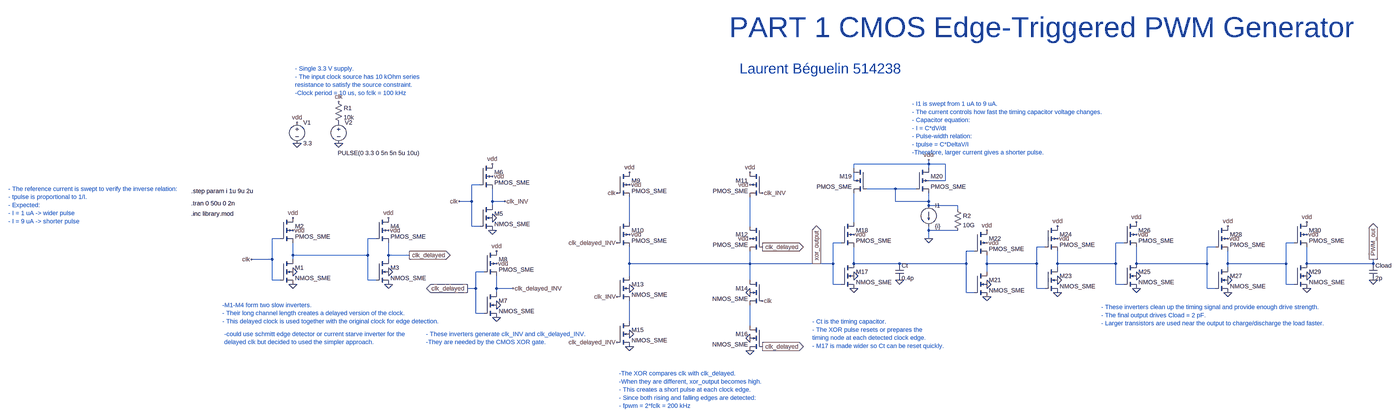
[diagram p0: schematic CMOS_Project_part1.asc, whole sheet]
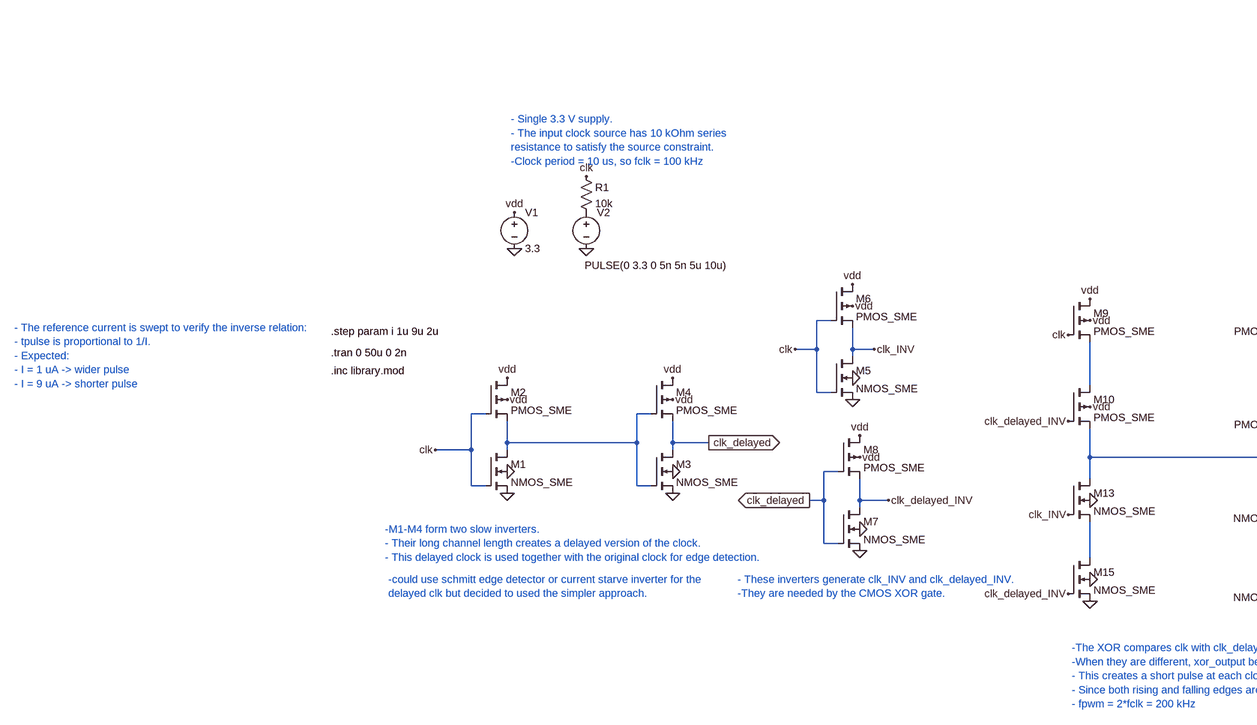
[diagram p1: schematic CMOS_Project_part1.asc, part, row 1 of 1, column 1 of 2]
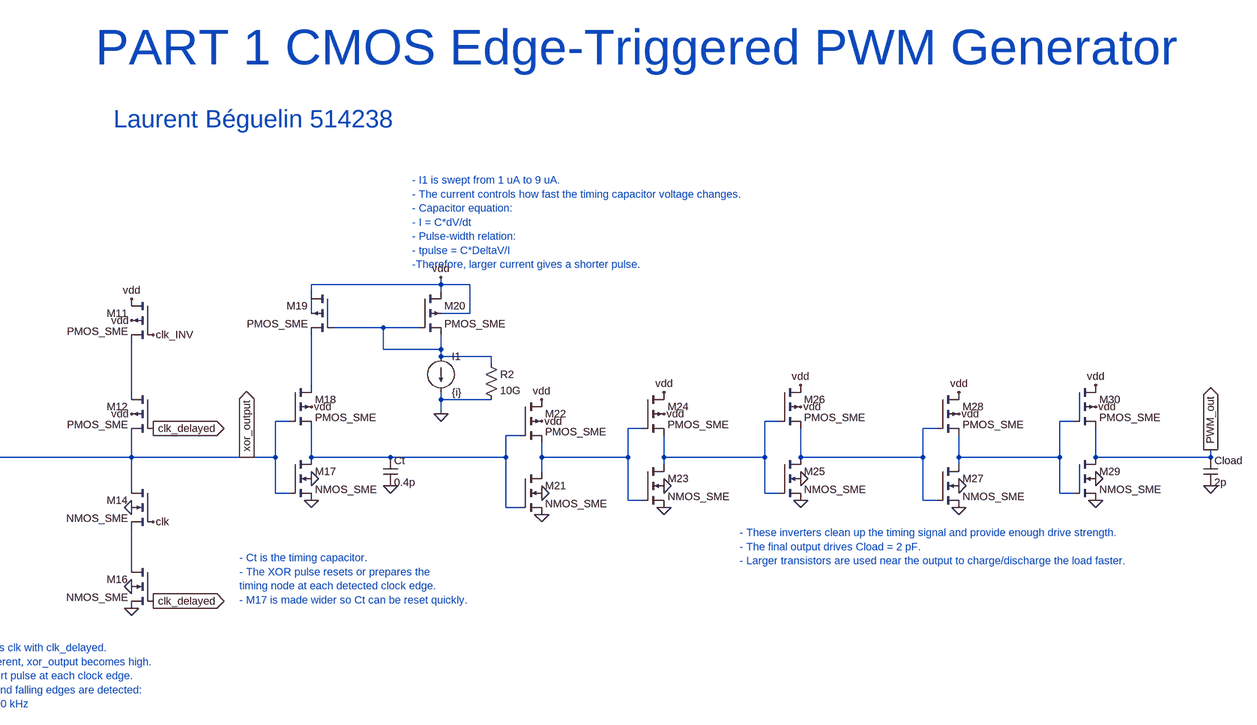
[diagram p2: schematic CMOS_Project_part1.asc, part, row 1 of 1, column 2 of 2]
CMOS_Project_part1.asc, the LTspice schematic file:
Version 4
SHEET 1 7728 1124
WIRE 2688 -128 2688 -144
WIRE 2688 -128 2400 -128
WIRE 2752 -128 2688 -128
WIRE 2400 -112 2400 -128
WIRE 2688 -112 2688 -128
WIRE 2400 -64 2400 -96
WIRE 2752 -64 2752 -128
WIRE 2752 -64 2688 -64
WIRE 960 -48 928 -48
WIRE 2560 -32 2448 -32
WIRE 2640 -32 2560 -32
WIRE 928 16 928 -48
WIRE 928 16 880 16
WIRE 1008 16 1008 -32
WIRE 1056 16 1008 16
WIRE 2560 16 2560 -32
WIRE 2688 16 2688 -16
WIRE 2688 16 2560 16
WIRE 1008 32 1008 16
WIRE 2688 32 2688 16
WIRE 2800 32 2688 32
WIRE 2800 48 2800 32
WIRE 1536 96 1536 0
WIRE 2400 96 2400 -16
WIRE 928 112 928 16
WIRE 960 112 928 112
WIRE 2000 112 2000 0
WIRE 2688 128 2688 112
WIRE 2800 128 2688 128
WIRE 192 160 160 160
WIRE 560 160 528 160
WIRE 2688 160 2688 128
WIRE 2352 176 2320 176
WIRE 3440 176 3408 176
WIRE 4096 176 4064 176
WIRE 3136 192 3104 192
WIRE 3792 192 3760 192
WIRE 2864 208 2832 208
WIRE 240 224 240 176
WIRE 528 224 528 160
WIRE 528 224 240 224
WIRE 608 224 608 176
WIRE 688 224 608 224
WIRE 160 240 160 160
WIRE 160 240 80 240
WIRE 240 240 240 224
WIRE 608 240 608 224
WIRE 1536 256 1536 192
WIRE 2000 256 2000 208
WIRE 2000 256 1536 256
WIRE 2256 256 2000 256
WIRE 2320 256 2320 176
WIRE 2320 256 2256 256
WIRE 2400 256 2400 192
WIRE 2576 256 2400 256
WIRE 2832 256 2832 208
WIRE 2832 256 2576 256
WIRE 2912 256 2912 224
WIRE 3104 256 3104 192
WIRE 3104 256 2912 256
WIRE 3184 256 3184 208
WIRE 3408 256 3408 176
WIRE 3408 256 3184 256
WIRE 3488 256 3488 192
WIRE 3760 256 3760 192
WIRE 3760 256 3488 256
WIRE 3840 256 3840 208
WIRE 4064 256 4064 176
WIRE 4064 256 3840 256
WIRE 4144 256 4144 192
WIRE 4400 256 4400 240
WIRE 4400 256 4144 256
WIRE 3184 272 3184 256
WIRE 3840 272 3840 256
WIRE 976 288 944 288
WIRE 2912 288 2912 256
WIRE 1536 304 1536 256
WIRE 160 320 160 240
WIRE 192 320 160 320
WIRE 528 320 528 224
WIRE 560 320 528 320
WIRE 2000 320 2000 256
WIRE 2320 336 2320 256
WIRE 2352 336 2320 336
WIRE 3408 336 3408 256
WIRE 3440 336 3408 336
WIRE 4064 336 4064 256
WIRE 4096 336 4064 336
WIRE 944 352 944 288
WIRE 944 352 912 352
WIRE 1024 352 1024 304
WIRE 1088 352 1024 352
WIRE 3104 352 3104 256
WIRE 3136 352 3104 352
WIRE 3760 352 3760 256
WIRE 3792 352 3760 352
WIRE 1024 368 1024 352
WIRE 2832 368 2832 256
WIRE 2864 368 2832 368
WIRE 944 448 944 352
WIRE 976 448 944 448
WIRE 1536 480 1536 400
WIRE 2000 496 2000 416
FLAG 416 -208 0
FLAG 240 288 0
FLAG 256 -208 0
FLAG 256 -288 vdd
FLAG 240 128 vdd
FLAG 608 336 0
FLAG 608 288 0
FLAG 608 80 vdd
FLAG 608 128 vdd
FLAG 240 336 0
FLAG 240 80 vdd
FLAG 1008 128 0
FLAG 1008 80 0
FLAG 1008 -128 vdd
FLAG 1008 -80 vdd
FLAG 1024 464 0
FLAG 1024 416 0
FLAG 1024 208 vdd
FLAG 1024 256 vdd
FLAG 1536 -96 vdd
FLAG 1536 -48 vdd
FLAG 1536 144 vdd
FLAG 2000 -96 vdd
FLAG 2000 -48 vdd
FLAG 2000 160 vdd
FLAG 1536 352 0
FLAG 2000 368 0
FLAG 1536 576 0
FLAG 1536 528 0
FLAG 2000 592 0
FLAG 2000 544 0
FLAG 2400 352 0
FLAG 2400 304 0
FLAG 2400 144 vdd
FLAG 2576 320 0
FLAG 2688 160 0
FLAG 2688 -144 vdd
FLAG 2912 384 0
FLAG 2912 336 0
FLAG 2912 128 vdd
FLAG 2912 176 vdd
FLAG 3184 368 0
FLAG 3184 320 0
FLAG 3184 112 vdd
FLAG 3184 160 vdd
FLAG 3488 352 0
FLAG 3488 304 0
FLAG 3488 96 vdd
FLAG 3488 144 vdd
FLAG 4400 320 0
FLAG 3840 368 0
FLAG 3840 320 0
FLAG 3840 112 vdd
FLAG 3840 160 vdd
FLAG 4144 352 0
FLAG 4144 304 0
FLAG 4144 96 vdd
FLAG 4144 144 vdd
FLAG 688 224 clk_delayed
IOPIN 688 224 Out
FLAG 416 -368 clk
FLAG 80 240 clk
FLAG 1088 352 clk_delayed_INV
FLAG 880 16 clk
FLAG 1056 16 clk_INV
FLAG 912 352 clk_delayed
IOPIN 912 352 Out
FLAG 1488 -16 clk
FLAG 2048 400 clk
FLAG 2048 -16 clk_INV
FLAG 1488 176 clk_delayed_INV
FLAG 1488 384 clk_INV
FLAG 1488 560 clk_delayed_INV
FLAG 2048 576 clk_delayed
IOPIN 2048 576 Out
FLAG 2048 192 clk_delayed
IOPIN 2048 192 Out
FLAG 4400 240 PWM_out
IOPIN 4400 240 Out
FLAG 2256 256 xor_output
IOPIN 2256 256 Out
SYMBOL nmos4 192 240 R0
SYMATTR InstName M1
SYMATTR Value NMOS_SME
SYMATTR Value2 l=3u w=0.4u
SYMBOL pmos4 192 80 R0
SYMATTR InstName M2
SYMATTR Value PMOS_SME
SYMATTR Value2 l=3u w=0.4u
SYMBOL voltage 256 -304 R0
WINDOW 123 0 0 Left 0
WINDOW 39 0 0 Left 0
SYMATTR InstName V1
SYMATTR Value 3.3
SYMBOL voltage 416 -304 R0
WINDOW 123 0 0 Left 0
WINDOW 39 0 0 Left 0
WINDOW 3 -4 134 Left 2
SYMATTR Value PULSE(0 3.3 0 5n 5n 5u 10u)
SYMATTR InstName V2
SYMBOL nmos4 560 240 R0
SYMATTR InstName M3
SYMATTR Value NMOS_SME
SYMATTR Value2 l=3u w=0.4u
SYMBOL pmos4 560 80 R0
SYMATTR InstName M4
SYMATTR Value PMOS_SME
SYMATTR Value2 l=3u w=0.4u
SYMBOL nmos4 960 32 R0
SYMATTR InstName M5
SYMATTR Value NMOS_SME
SYMATTR Value2 l=0.35u w=0.4u
SYMBOL pmos4 960 -128 R0
SYMATTR InstName M6
SYMATTR Value PMOS_SME
SYMATTR Value2 l=0.35u w=0.4u
SYMBOL nmos4 976 368 R0
SYMATTR InstName M7
SYMATTR Value NMOS_SME
SYMATTR Value2 l=0.35u w=0.4u
SYMBOL pmos4 976 208 R0
SYMATTR InstName M8
SYMATTR Value PMOS_SME
SYMATTR Value2 l=0.35u w=0.4u
SYMBOL pmos4 1488 -96 R0
SYMATTR InstName M9
SYMATTR Value PMOS_SME
SYMATTR Value2 l=0.35u w=0.4u
SYMBOL pmos4 1488 96 R0
SYMATTR InstName M10
SYMATTR Value PMOS_SME
SYMATTR Value2 l=0.35u w=0.4u
SYMBOL pmos4 2048 -96 M0
SYMATTR InstName M11
SYMATTR Value PMOS_SME
SYMATTR Value2 l=0.35u w=0.4u
SYMBOL pmos4 2048 112 M0
SYMATTR InstName M12
SYMATTR Value PMOS_SME
SYMATTR Value2 l=0.35u w=0.4u
SYMBOL nmos4 1488 304 R0
SYMATTR InstName M13
SYMATTR Value NMOS_SME
SYMATTR Value2 l=0.35u w=0.4u
SYMBOL nmos4 2048 320 M0
SYMATTR InstName M14
SYMATTR Value NMOS_SME
SYMATTR Value2 l=0.35u w=0.4u
SYMBOL nmos4 1488 480 R0
SYMATTR InstName M15
SYMATTR Value NMOS_SME
SYMATTR Value2 l=0.35u w=0.4u
SYMBOL nmos4 2048 496 M0
SYMATTR InstName M16
SYMATTR Value NMOS_SME
SYMATTR Value2 l=0.35u w=0.4u
SYMBOL nmos4 2352 256 R0
SYMATTR InstName M17
SYMATTR Value NMOS_SME
SYMATTR Value2 l=0.35u w=4u
SYMBOL pmos4 2352 96 R0
SYMATTR InstName M18
SYMATTR Value PMOS_SME
SYMATTR Value2 l=0.35u w=0.4u
SYMBOL cap 2560 256 R0
SYMATTR InstName Ct
SYMATTR Value 0.4p
SYMBOL pmos4 2448 -112 M0
SYMATTR InstName M19
SYMATTR Value PMOS_SME
SYMATTR Value2 l=0.35u w=0.4u
SYMBOL pmos4 2640 -112 R0
SYMATTR InstName M20
SYMATTR Value PMOS_SME
SYMATTR Value2 l=0.35u w=2u
SYMBOL current 2688 32 R0
WINDOW 123 0 0 Left 0
WINDOW 39 0 0 Left 0
SYMATTR InstName I1
SYMATTR Value {i}
SYMBOL res 2784 32 R0
SYMATTR InstName R2
SYMATTR Value 10G
SYMBOL nmos4 2864 288 R0
SYMATTR InstName M21
SYMATTR Value NMOS_SME
SYMATTR Value2 l=0.35u w=4u
SYMBOL pmos4 2864 128 R0
SYMATTR InstName M22
SYMATTR Value PMOS_SME
SYMATTR Value2 l=0.35u w=3.5u
SYMBOL nmos4 3136 272 R0
SYMATTR InstName M23
SYMATTR Value NMOS_SME
SYMATTR Value2 l=0.35u w=2u
SYMBOL pmos4 3136 112 R0
SYMATTR InstName M24
SYMATTR Value PMOS_SME
SYMATTR Value2 l=0.35u w=2u
SYMBOL nmos4 3440 256 R0
SYMATTR InstName M25
SYMATTR Value NMOS_SME
SYMATTR Value2 l=0.35u w=4u
SYMBOL pmos4 3440 96 R0
SYMATTR InstName M26
SYMATTR Value PMOS_SME
SYMATTR Value2 l=0.35u w=4u
SYMBOL cap 4384 256 R0
SYMATTR InstName Cload
SYMATTR Value 2p
SYMBOL nmos4 3792 272 R0
SYMATTR InstName M27
SYMATTR Value NMOS_SME
SYMATTR Value2 l=0.35u w=5u
SYMBOL pmos4 3792 112 R0
SYMATTR InstName M28
SYMATTR Value PMOS_SME
SYMATTR Value2 l=0.35u w=5u
SYMBOL nmos4 4096 256 R0
SYMATTR InstName M29
SYMATTR Value NMOS_SME
SYMATTR Value2 l=0.35u w=6u
SYMBOL pmos4 4096 96 R0
SYMATTR InstName M30
SYMATTR Value PMOS_SME
SYMATTR Value2 l=0.35u w=6u
SYMBOL Res 400 -384 R0
SYMATTR InstName R1
SYMATTR Value 10k
TEXT -152 64 Left 2 !.inc library.mod
TEXT -152 24 Left 2 !.tran 0 50u 0 2n
TEXT 1496 680 Left 2 ;-The XOR compares clk with clk_delayed.\n-When they are different, xor_output becomes high.\n- This creates a short pulse at each clock edge.\n- Since both rising and falling edges are detected:\n- fpwm = 2*fclk = 200 kHz
TEXT 2240 480 Left 2 ;- Ct is the timing capacitor.\n- The XOR pulse resets or prepares the \ntiming node at each detected clock edge.\n- M17 is made wider so Ct can be reset quickly.
TEXT 3352 424 Left 2 ;- These inverters clean up the timing signal and provide enough drive strength.\n- The final output drives Cload = 2 pF.\n- Larger transistors are used near the output to charge/discharge the load faster.
TEXT -152 -24 Left 2 !.step param i 1u 9u 2u
TEXT 1920 -656 Left 7 ;PART 1 CMOS Edge-Triggered PWM Generator
TEXT -24 528 Left 2 ;-could use schmitt edge detector or current starve inverter for the \ndelayed clk but decided to used the simpler approach.
TEXT 1960 -496 Left 5 ;Laurent Béguelin 514238
TEXT -32 416 Left 2 ;-M1-M4 form two slow inverters.\n- Their long channel length creates a delayed version of the clock.\n- This delayed clock is used together with the original clock for edge detection.
TEXT 752 528 Left 2 ;- These inverters generate clk_INV and clk_delayed_INV.\n-They are needed by the CMOS XOR gate.
TEXT 248 -496 Left 2 ;- Single 3.3 V supply.\n- The input clock source has 10 kOhm series \nresistance to satisfy the source constraint.\n-Clock period = 10 us, so fclk = 100 kHz
TEXT 2624 -360 Left 2 ;- I1 is swept from 1 uA to 9 uA.\n- The current controls how fast the timing capacitor voltage changes.\n- Capacitor equation:\n- I = C*dV/dt\n- Pulse-width relation:\n- tpulse = C*DeltaV/I\n-Therefore, larger current gives a shorter pulse.
TEXT -856 -32 Left 2 ;- The reference current is swept to verify the inverse relation:\n- tpulse is proportional to 1/I.\n- Expected:\n- I = 1 uA -> wider pulse\n- I = 9 uA -> shorter pulse

The netlist it stands for:
* CMOS_Project_part1.asc
M1 N006 clk 0 0 NMOS_SME l=3u w=0.4u
M2 vdd clk N006 vdd PMOS_SME l=3u w=0.4u
V1 vdd 0 3.3
V2 P001 0 PULSE(0 3.3 0 5n 5n 5u 10u)
M3 clk_delayed N006 0 0 NMOS_SME l=3u w=0.4u
M4 vdd N006 clk_delayed vdd PMOS_SME l=3u w=0.4u
M5 clk_INV clk 0 0 NMOS_SME l=0.35u w=0.4u
M6 vdd clk clk_INV vdd PMOS_SME l=0.35u w=0.4u
M7 clk_delayed_INV clk_delayed 0 0 NMOS_SME l=0.35u w=0.4u
M8 vdd clk_delayed clk_delayed_INV vdd PMOS_SME l=0.35u w=0.4u
M9 vdd clk N003 vdd PMOS_SME l=0.35u w=0.4u
M10 N003 clk_delayed_INV xor_output vdd PMOS_SME l=0.35u w=0.4u
M11 vdd clk_INV N005 vdd PMOS_SME l=0.35u w=0.4u
M12 N005 clk_delayed xor_output vdd PMOS_SME l=0.35u w=0.4u
M13 xor_output clk_INV N012 0 NMOS_SME l=0.35u w=0.4u
M14 xor_output clk N013 0 NMOS_SME l=0.35u w=0.4u
M15 N012 clk_delayed_INV 0 0 NMOS_SME l=0.35u w=0.4u
M16 N013 clk_delayed 0 0 NMOS_SME l=0.35u w=0.4u
M17 N011 xor_output 0 0 NMOS_SME l=0.35u w=4u
M18 N004 xor_output N011 vdd PMOS_SME l=0.35u w=0.4u
Ct N011 0 0.4p
M19 vdd N002 N004 N001 PMOS_SME l=0.35u w=0.4u
M20 vdd N002 N002 vdd PMOS_SME l=0.35u w=2u
I1 N002 0 {i}
R2 N002 0 10G
M21 N009 N011 0 0 NMOS_SME l=0.35u w=4u
M22 vdd N011 N009 vdd PMOS_SME l=0.35u w=3.5u
M23 N007 N009 0 0 NMOS_SME l=0.35u w=2u
M24 vdd N009 N007 vdd PMOS_SME l=0.35u w=2u
M25 N010 N007 0 0 NMOS_SME l=0.35u w=4u
M26 vdd N007 N010 vdd PMOS_SME l=0.35u w=4u
Cload PWM_out 0 2p
M27 N008 N010 0 0 NMOS_SME l=0.35u w=5u
M28 vdd N010 N008 vdd PMOS_SME l=0.35u w=5u
M29 PWM_out N008 0 0 NMOS_SME l=0.35u w=6u
M30 vdd N008 PWM_out vdd PMOS_SME l=0.35u w=6u
R1 clk P001 10k
.model NMOS NMOS
.model PMOS PMOS
.lib standard.mos
.inc library.mod
.tran 0 50u 0 2n
* -The XOR compares clk with clk_delayed.
* -When they are different, xor_output becomes high.
* - This creates a short pulse at each clock edge.
* - Since both rising and falling edges are detected:
* - fpwm = 2*fclk = 200 kHz
* - Ct is the timing capacitor.
* - The XOR pulse resets or prepares the
* timing node at each detected clock edge.
* - M17 is made wider so Ct can be reset quickly.
* - These inverters clean up the timing signal and provide enough drive strength.
* - The final output drives Cload = 2 pF.
* - Larger transistors are used near the output to charge/discharge the load faster.
.step param i 1u 9u 2u
* PART 1 CMOS Edge-Triggered PWM Generator
* -could use schmitt edge detector or current starve inverter for the
* delayed clk but decided to used the simpler approach.
* Laurent Béguelin 514238
* -M1-M4 form two slow inverters.
* - Their long channel length creates a delayed version of the clock.
* - This delayed clock is used together with the original clock for edge detection.
* - These inverters generate clk_INV and clk_delayed_INV.
* -They are needed by the CMOS XOR gate.
* - Single 3.3 V supply.
* - The input clock source has 10 kOhm series
* resistance to satisfy the source constraint.
* -Clock period = 10 us, so fclk = 100 kHz
* - I1 is swept from 1 uA to 9 uA.
* - The current controls how fast the timing capacitor voltage changes.
* - Capacitor equation:
* - I = C*dV/dt
* - Pulse-width relation:
* - tpulse = C*DeltaV/I
* -Therefore, larger current gives a shorter pulse.
* - The reference current is swept to verify the inverse relation:
* - tpulse is proportional to 1/I.
* - Expected:
* - I = 1 uA -> wider pulse
* - I = 9 uA -> shorter pulse
.backanno
.end